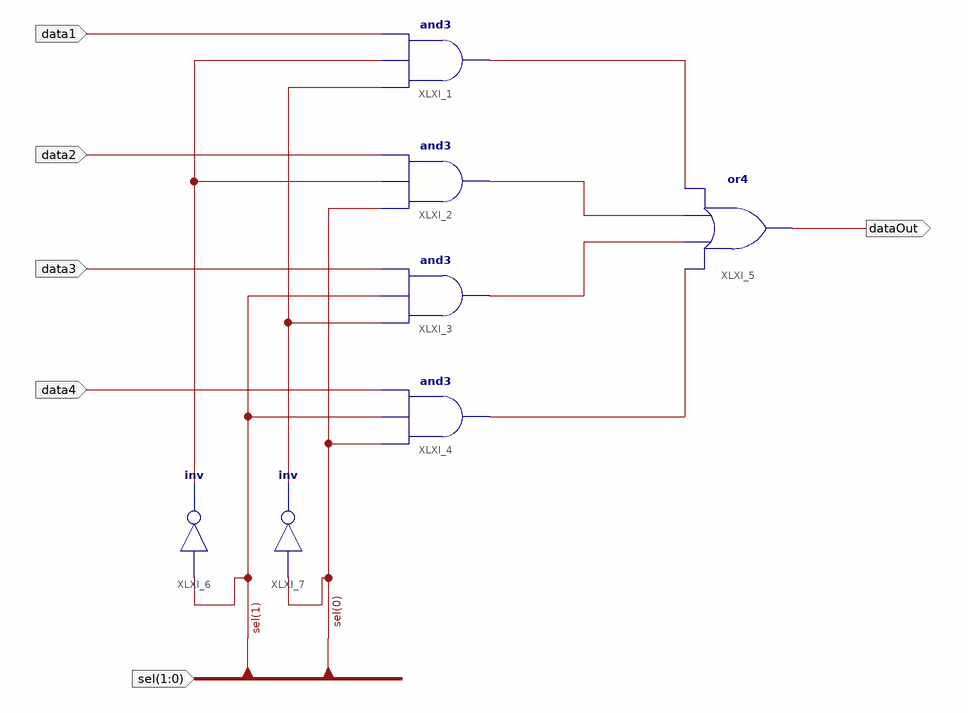
[diagram p0: schematic sheet 1]
// Xilinx ISE schematic Mux4_1.sch (spartan6) as structural Verilog: 7 symbols, 6 ports
module Mux4_1 (
  input  [1:0] sel,
  input  data4,
  input  data3,
  input  data2,
  input  data1,
  output dataOut
);

  wire XLXN_1, XLXN_2, XLXN_3, XLXN_4, XLXN_19, XLXN_20;

  and XLXI_1 (XLXN_1, XLXN_19, XLXN_20, data1);
  and XLXI_2 (XLXN_2, sel[0], XLXN_20, data2);
  and XLXI_3 (XLXN_3, XLXN_19, sel[1], data3);
  and XLXI_4 (XLXN_4, sel[0], sel[1], data4);
  or XLXI_5 (dataOut, XLXN_4, XLXN_3, XLXN_2, XLXN_1);
  not XLXI_6 (XLXN_20, sel[1]);
  not XLXI_7 (XLXN_19, sel[0]);
endmodule
